# Altium schematic sheet 25Q80_SO.SchDoc
size A4
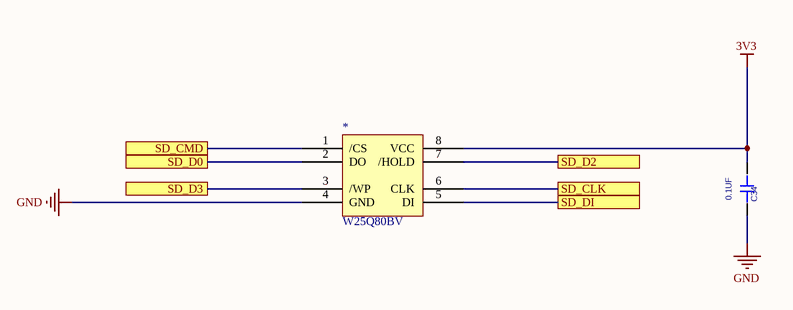
[diagram p0: 25Q80_SO.SchDoc]

## Parts
*  W25Q80BV  [W25Q80BV]
C34  value 0.1UF  [CAP_0603_FIRE]  (hidden comment: CAP_0.1UF_0603_FIRE)

## Ports
SD_CLK, SD_CMD, SD_D0, SD_D2, SD_D3, SD_DI

## Nets
3V3: *.8(VCC) C34.2
GND: *.4(GND) C34.1
SD_CLK: *.6(CLK) ; port SD_CLK
SD_CMD: *.1(/CS) ; port SD_CMD
SD_D0: *.2(DO) ; port SD_D0
SD_D2: *.7(/HOLD) ; port SD_D2
SD_D3: *.3(/WP) ; port SD_D3
SD_DI: *.5(DI) ; port SD_DI

## Library data of the parts
C34 = CAP_0.1UF_0603_FIRE: SURFACE MOUNT CAPACITOR 0.031 X 0.061 INCHES; PCB DECAL: CAP_0603_FIRE